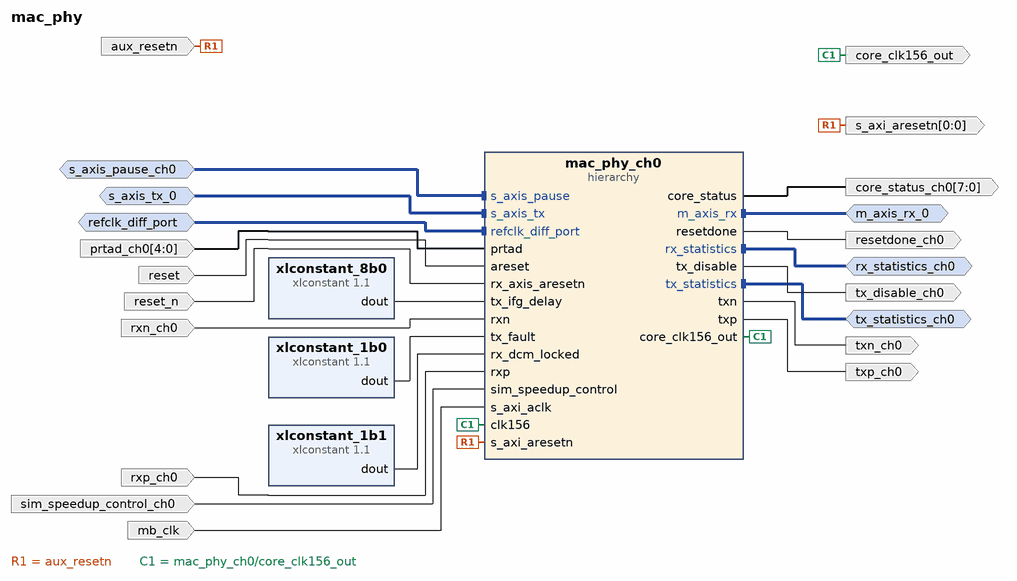
[diagram p0: block diagram of the top level]
# Vivado block design mac_phy, xcku040-ffva1156-2-e, Vivado 2020.2
create_bd_design mac_phy

create_bd_intf_port -mode Slave -vlnv xilinx.com:interface:diff_clock_rtl:1.0 refclk_diff_port
set_property -dict {CONFIG.FREQ_HZ 156250000} [get_bd_intf_ports refclk_diff_port]
create_bd_intf_port -mode Master -vlnv xilinx.com:display_ten_gig_eth_mac:statistics_rtl:2.0 rx_statistics_ch0
create_bd_intf_port -mode Slave -vlnv xilinx.com:interface:axis_rtl:1.0 s_axis_pause_ch0
set_property -dict [list \
  CONFIG.HAS_TKEEP 0 \
  CONFIG.HAS_TLAST 0 \
  CONFIG.HAS_TREADY 0 \
  CONFIG.HAS_TSTRB 0 \
  CONFIG.LAYERED_METADATA undef \
  CONFIG.PHASE 0.000 \
  CONFIG.TDATA_NUM_BYTES 2 \
  CONFIG.TDEST_WIDTH 0 \
  CONFIG.TID_WIDTH 0 \
  CONFIG.TUSER_WIDTH 0 \
] [get_bd_intf_ports s_axis_pause_ch0]
create_bd_intf_port -mode Master -vlnv xilinx.com:display_ten_gig_eth_mac:statistics_rtl:2.0 tx_statistics_ch0
create_bd_intf_port -mode Slave -vlnv xilinx.com:interface:axis_rtl:1.0 s_axis_tx_0
set_property -dict [list \
  CONFIG.FREQ_HZ 156250000 \
  CONFIG.HAS_TKEEP 1 \
  CONFIG.HAS_TLAST 1 \
  CONFIG.HAS_TREADY 1 \
  CONFIG.HAS_TSTRB 0 \
  CONFIG.LAYERED_METADATA undef \
  CONFIG.TDATA_NUM_BYTES 8 \
  CONFIG.TDEST_WIDTH 0 \
  CONFIG.TID_WIDTH 0 \
  CONFIG.TUSER_WIDTH 1 \
] [get_bd_intf_ports s_axis_tx_0]
create_bd_intf_port -mode Master -vlnv xilinx.com:interface:axis_rtl:1.0 m_axis_rx_0
set_property -dict {CONFIG.FREQ_HZ 156250000} [get_bd_intf_ports m_axis_rx_0]
create_bd_port -dir I -type rst aux_resetn
create_bd_port -dir O -type clk core_clk156_out
set_property -dict {CONFIG.ASSOCIATED_BUSIF s_axis_pause_ch1:s_axis_pause_ch0} [get_bd_ports core_clk156_out]
create_bd_port -dir O resetdone_ch0
create_bd_port -dir I -from 4 -to 0 prtad_ch0
create_bd_port -dir I -type rst reset
set_property -dict {CONFIG.POLARITY ACTIVE_HIGH} [get_bd_ports reset]
create_bd_port -dir I reset_n
create_bd_port -dir O -from 0 -to 0 -type rst s_axi_aresetn
create_bd_port -dir I rxn_ch0
create_bd_port -dir I rxp_ch0
create_bd_port -dir I sim_speedup_control_ch0
create_bd_port -dir O tx_disable_ch0
create_bd_port -dir O txn_ch0
create_bd_port -dir O txp_ch0
create_bd_port -dir O -from 7 -to 0 core_status_ch0
create_bd_port -dir I -type clk mb_clk
set_property -dict {CONFIG.FREQ_HZ 156250000} [get_bd_ports mb_clk]

create_bd_cell -type hier mac_phy_ch0
create_bd_cell -type ip -vlnv xilinx.com:ip:xlconstant:1.1 xlconstant_1b0
set_property -dict {CONFIG.CONST_VAL 0} [get_bd_cells xlconstant_1b0]
create_bd_cell -type ip -vlnv xilinx.com:ip:xlconstant:1.1 xlconstant_1b1
create_bd_cell -type ip -vlnv xilinx.com:ip:xlconstant:1.1 xlconstant_8b0
set_property -dict {CONFIG.CONST_VAL 0 CONFIG.CONST_WIDTH 8} [get_bd_cells xlconstant_8b0]

# ---- hierarchy /mac_phy_ch0 ----
current_bd_instance /mac_phy_ch0
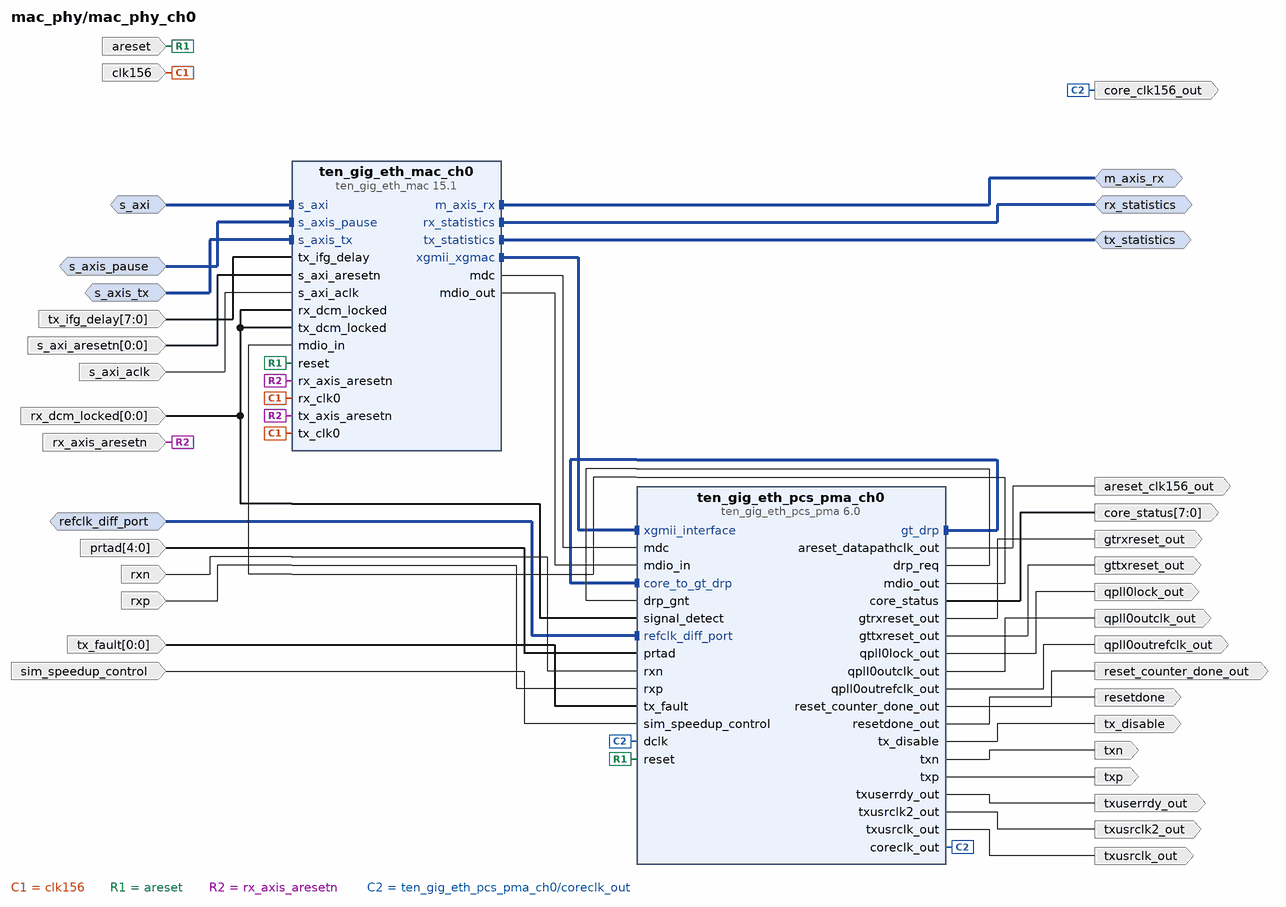
[diagram p1: block diagram inside /mac_phy_ch0]
create_bd_intf_pin -mode Master -vlnv xilinx.com:interface:axis_rtl:1.0 m_axis_rx
create_bd_intf_pin -mode Slave -vlnv xilinx.com:interface:diff_clock_rtl:1.0 refclk_diff_port
create_bd_intf_pin -mode Master -vlnv xilinx.com:display_ten_gig_eth_mac:statistics_rtl:2.0 rx_statistics
create_bd_intf_pin -mode Slave -vlnv xilinx.com:interface:aximm_rtl:1.0 s_axi
create_bd_intf_pin -mode Slave -vlnv xilinx.com:interface:axis_rtl:1.0 s_axis_pause
create_bd_intf_pin -mode Slave -vlnv xilinx.com:interface:axis_rtl:1.0 s_axis_tx
create_bd_intf_pin -mode Master -vlnv xilinx.com:display_ten_gig_eth_mac:statistics_rtl:2.0 tx_statistics
create_bd_pin -dir I areset
create_bd_pin -dir O -type rst areset_clk156_out
create_bd_pin -dir I -type clk clk156
create_bd_pin -dir O -type clk core_clk156_out
create_bd_pin -dir O -from 7 -to 0 core_status
create_bd_pin -dir O -type rst gtrxreset_out
create_bd_pin -dir O -type rst gttxreset_out
create_bd_pin -dir I -from 4 -to 0 prtad
create_bd_pin -dir O qpll0lock_out
create_bd_pin -dir O -type clk qpll0outclk_out
create_bd_pin -dir O -type clk qpll0outrefclk_out
create_bd_pin -dir O reset_counter_done_out
create_bd_pin -dir O resetdone
create_bd_pin -dir I -type rst rx_axis_aresetn
create_bd_pin -dir I -from 0 -to 0 rx_dcm_locked
create_bd_pin -dir I rxn
create_bd_pin -dir I rxp
create_bd_pin -dir I s_axi_aclk
create_bd_pin -dir I -from 0 -to 0 s_axi_aresetn
create_bd_pin -dir I sim_speedup_control
create_bd_pin -dir O tx_disable
create_bd_pin -dir I -from 0 -to 0 tx_fault
create_bd_pin -dir I -from 7 -to 0 tx_ifg_delay
create_bd_pin -dir O txn
create_bd_pin -dir O txp
create_bd_pin -dir O txuserrdy_out
create_bd_pin -dir O -type clk txusrclk2_out
create_bd_pin -dir O -type clk txusrclk_out

create_bd_cell -type ip -vlnv xilinx.com:ip:ten_gig_eth_mac:15.1 ten_gig_eth_mac_ch0
create_bd_cell -type ip -vlnv xilinx.com:ip:ten_gig_eth_pcs_pma:6.0 ten_gig_eth_pcs_pma_ch0
set_property -dict {CONFIG.Locations X0Y10 CONFIG.SupportLevel 1 CONFIG.base_kr BASE-R} [get_bd_cells ten_gig_eth_pcs_pma_ch0]

# ---- connections ----

current_bd_instance /mac_phy_ch0
connect_bd_intf_net [get_bd_intf_pins ten_gig_eth_pcs_pma_ch0/core_to_gt_drp] [get_bd_intf_pins ten_gig_eth_pcs_pma_ch0/gt_drp]
connect_bd_intf_net [get_bd_intf_pins rx_statistics] [get_bd_intf_pins ten_gig_eth_mac_ch0/rx_statistics]
connect_bd_intf_net [get_bd_intf_pins s_axi] [get_bd_intf_pins ten_gig_eth_mac_ch0/s_axi]
connect_bd_intf_net [get_bd_intf_pins refclk_diff_port] [get_bd_intf_pins ten_gig_eth_pcs_pma_ch0/refclk_diff_port]
connect_bd_intf_net [get_bd_intf_pins ten_gig_eth_mac_ch0/xgmii_xgmac] [get_bd_intf_pins ten_gig_eth_pcs_pma_ch0/xgmii_interface]
connect_bd_intf_net [get_bd_intf_pins tx_statistics] [get_bd_intf_pins ten_gig_eth_mac_ch0/tx_statistics]
connect_bd_intf_net [get_bd_intf_pins s_axis_pause] [get_bd_intf_pins ten_gig_eth_mac_ch0/s_axis_pause]
connect_bd_intf_net -intf_net axis_data_fifo_tx_ch0_M_AXIS [get_bd_intf_pins s_axis_tx] [get_bd_intf_pins ten_gig_eth_mac_ch0/s_axis_tx]
connect_bd_intf_net [get_bd_intf_pins m_axis_rx] [get_bd_intf_pins ten_gig_eth_mac_ch0/m_axis_rx]
connect_bd_net -net hdp_patgen_0_tx_ifg_delay [get_bd_pins tx_ifg_delay] [get_bd_pins ten_gig_eth_mac_ch0/tx_ifg_delay]
connect_bd_net -net microblaze_0_Clk [get_bd_pins clk156] [get_bd_pins ten_gig_eth_mac_ch0/tx_clk0] [get_bd_pins ten_gig_eth_mac_ch0/rx_clk0]
connect_bd_net [get_bd_pins prtad] [get_bd_pins ten_gig_eth_pcs_pma_ch0/prtad]
connect_bd_net -net reset_mac [get_bd_pins areset] [get_bd_pins ten_gig_eth_mac_ch0/reset] [get_bd_pins ten_gig_eth_pcs_pma_ch0/reset]
connect_bd_net -net reset_n_mac_1 [get_bd_pins rx_axis_aresetn] \
  [get_bd_pins ten_gig_eth_mac_ch0/tx_axis_aresetn] [get_bd_pins ten_gig_eth_mac_ch0/rx_axis_aresetn]
connect_bd_net -net rst_clk_156_156M_peripheral_aresetn [get_bd_pins s_axi_aresetn] [get_bd_pins ten_gig_eth_mac_ch0/s_axi_aresetn]
connect_bd_net [get_bd_pins rxn] [get_bd_pins ten_gig_eth_pcs_pma_ch0/rxn]
connect_bd_net [get_bd_pins rxp] [get_bd_pins ten_gig_eth_pcs_pma_ch0/rxp]
connect_bd_net [get_bd_pins s_axi_aclk] [get_bd_pins ten_gig_eth_mac_ch0/s_axi_aclk]
connect_bd_net -net s_axis_pause_tvalid_1 [get_bd_pins tx_fault] [get_bd_pins ten_gig_eth_pcs_pma_ch0/tx_fault]
connect_bd_net [get_bd_pins sim_speedup_control] [get_bd_pins ten_gig_eth_pcs_pma_ch0/sim_speedup_control]
connect_bd_net [get_bd_pins ten_gig_eth_mac_ch0/mdc] [get_bd_pins ten_gig_eth_pcs_pma_ch0/mdc]
connect_bd_net [get_bd_pins ten_gig_eth_mac_ch0/mdio_out] [get_bd_pins ten_gig_eth_pcs_pma_ch0/mdio_in]
connect_bd_net -net ten_gig_eth_pcs_pma_ch0_areset_clk156_out [get_bd_pins ten_gig_eth_pcs_pma_ch0/areset_datapathclk_out] \
  [get_bd_pins areset_clk156_out]
connect_bd_net -net ten_gig_eth_pcs_pma_ch0_core_clk156_out [get_bd_pins ten_gig_eth_pcs_pma_ch0/coreclk_out] \
  [get_bd_pins core_clk156_out] [get_bd_pins ten_gig_eth_pcs_pma_ch0/dclk]
connect_bd_net [get_bd_pins ten_gig_eth_pcs_pma_ch0/core_status] [get_bd_pins core_status]
connect_bd_net [get_bd_pins ten_gig_eth_pcs_pma_ch0/drp_req] [get_bd_pins ten_gig_eth_pcs_pma_ch0/drp_gnt]
connect_bd_net [get_bd_pins ten_gig_eth_pcs_pma_ch0/gtrxreset_out] [get_bd_pins gtrxreset_out]
connect_bd_net [get_bd_pins ten_gig_eth_pcs_pma_ch0/gttxreset_out] [get_bd_pins gttxreset_out]
connect_bd_net [get_bd_pins ten_gig_eth_pcs_pma_ch0/mdio_out] [get_bd_pins ten_gig_eth_mac_ch0/mdio_in]
connect_bd_net [get_bd_pins ten_gig_eth_pcs_pma_ch0/qpll0lock_out] [get_bd_pins qpll0lock_out]
connect_bd_net [get_bd_pins ten_gig_eth_pcs_pma_ch0/qpll0outclk_out] [get_bd_pins qpll0outclk_out]
connect_bd_net [get_bd_pins ten_gig_eth_pcs_pma_ch0/qpll0outrefclk_out] [get_bd_pins qpll0outrefclk_out]
connect_bd_net [get_bd_pins ten_gig_eth_pcs_pma_ch0/reset_counter_done_out] [get_bd_pins reset_counter_done_out]
connect_bd_net -net ten_gig_eth_pcs_pma_ch0_resetdone [get_bd_pins ten_gig_eth_pcs_pma_ch0/resetdone_out] [get_bd_pins resetdone]
connect_bd_net [get_bd_pins ten_gig_eth_pcs_pma_ch0/tx_disable] [get_bd_pins tx_disable]
connect_bd_net [get_bd_pins ten_gig_eth_pcs_pma_ch0/txn] [get_bd_pins txn]
connect_bd_net [get_bd_pins ten_gig_eth_pcs_pma_ch0/txp] [get_bd_pins txp]
connect_bd_net [get_bd_pins ten_gig_eth_pcs_pma_ch0/txuserrdy_out] [get_bd_pins txuserrdy_out]
connect_bd_net [get_bd_pins ten_gig_eth_pcs_pma_ch0/txusrclk2_out] [get_bd_pins txusrclk2_out]
connect_bd_net [get_bd_pins ten_gig_eth_pcs_pma_ch0/txusrclk_out] [get_bd_pins txusrclk_out]
connect_bd_net -net xlconstant_0_const [get_bd_pins rx_dcm_locked] \
  [get_bd_pins ten_gig_eth_mac_ch0/tx_dcm_locked] [get_bd_pins ten_gig_eth_mac_ch0/rx_dcm_locked] \
  [get_bd_pins ten_gig_eth_pcs_pma_ch0/signal_detect]

current_bd_instance /
connect_bd_intf_net [get_bd_intf_ports s_axis_pause_ch0] [get_bd_intf_pins mac_phy_ch0/s_axis_pause]
connect_bd_intf_net [get_bd_intf_ports rx_statistics_ch0] [get_bd_intf_pins mac_phy_ch0/rx_statistics]
connect_bd_intf_net [get_bd_intf_ports m_axis_rx_0] [get_bd_intf_pins mac_phy_ch0/m_axis_rx]
connect_bd_intf_net -intf_net s_axis_tx_0_1 [get_bd_intf_ports s_axis_tx_0] [get_bd_intf_pins mac_phy_ch0/s_axis_tx]
connect_bd_intf_net [get_bd_intf_ports refclk_diff_port] [get_bd_intf_pins mac_phy_ch0/refclk_diff_port]
connect_bd_intf_net [get_bd_intf_ports tx_statistics_ch0] [get_bd_intf_pins mac_phy_ch0/tx_statistics]
connect_bd_net -net mac_phy_ch0_resetdone [get_bd_pins mac_phy_ch0/resetdone] [get_bd_ports resetdone_ch0]
connect_bd_net -net prtad_1 [get_bd_ports prtad_ch0] [get_bd_pins mac_phy_ch0/prtad]
connect_bd_net [get_bd_ports reset] [get_bd_pins mac_phy_ch0/areset]
connect_bd_net -net reset_n_mac_1 [get_bd_ports reset_n] [get_bd_pins mac_phy_ch0/rx_axis_aresetn]
connect_bd_net -net rst_clk_156_156M_peripheral_aresetn [get_bd_ports aux_resetn] [get_bd_ports s_axi_aresetn] [get_bd_pins mac_phy_ch0/s_axi_aresetn]
connect_bd_net -net rxn_1 [get_bd_ports rxn_ch0] [get_bd_pins mac_phy_ch0/rxn]
connect_bd_net -net rxp_1 [get_bd_ports rxp_ch0] [get_bd_pins mac_phy_ch0/rxp]
connect_bd_net -net s_axis_pause_tdata_1 [get_bd_pins xlconstant_8b0/dout] [get_bd_pins mac_phy_ch0/tx_ifg_delay]
connect_bd_net -net s_axis_pause_tvalid_1 [get_bd_pins xlconstant_1b0/dout] [get_bd_pins mac_phy_ch0/tx_fault]
connect_bd_net -net sim_speedup_control_1 [get_bd_ports sim_speedup_control_ch0] [get_bd_pins mac_phy_ch0/sim_speedup_control]
connect_bd_net -net ten_gig_eth_pcs_pma_ch0_tx_disable [get_bd_pins mac_phy_ch0/tx_disable] [get_bd_ports tx_disable_ch0]
connect_bd_net -net ten_gig_eth_pcs_pma_ch0_txn [get_bd_pins mac_phy_ch0/txn] [get_bd_ports txn_ch0]
connect_bd_net -net ten_gig_eth_pcs_pma_ch0_txp [get_bd_pins mac_phy_ch0/txp] [get_bd_ports txp_ch0]
connect_bd_net -net xlconstant_0_const [get_bd_pins xlconstant_1b1/dout] [get_bd_pins mac_phy_ch0/rx_dcm_locked]
connect_bd_net [get_bd_pins mac_phy_ch0/core_status] [get_bd_ports core_status_ch0]
connect_bd_net -net microblaze_0_Clk [get_bd_ports mb_clk] [get_bd_pins mac_phy_ch0/s_axi_aclk]
connect_bd_net [get_bd_pins mac_phy_ch0/core_clk156_out] [get_bd_ports core_clk156_out] [get_bd_pins mac_phy_ch0/clk156]
set_property HDL_ATTRIBUTE.DEBUG_IN_BD true [get_bd_nets mac_phy_ch0_resetdone]

validate_bd_design
save_bd_design
